# EAGLE design TeensySonarBoard (EAGLE 7.7.0)
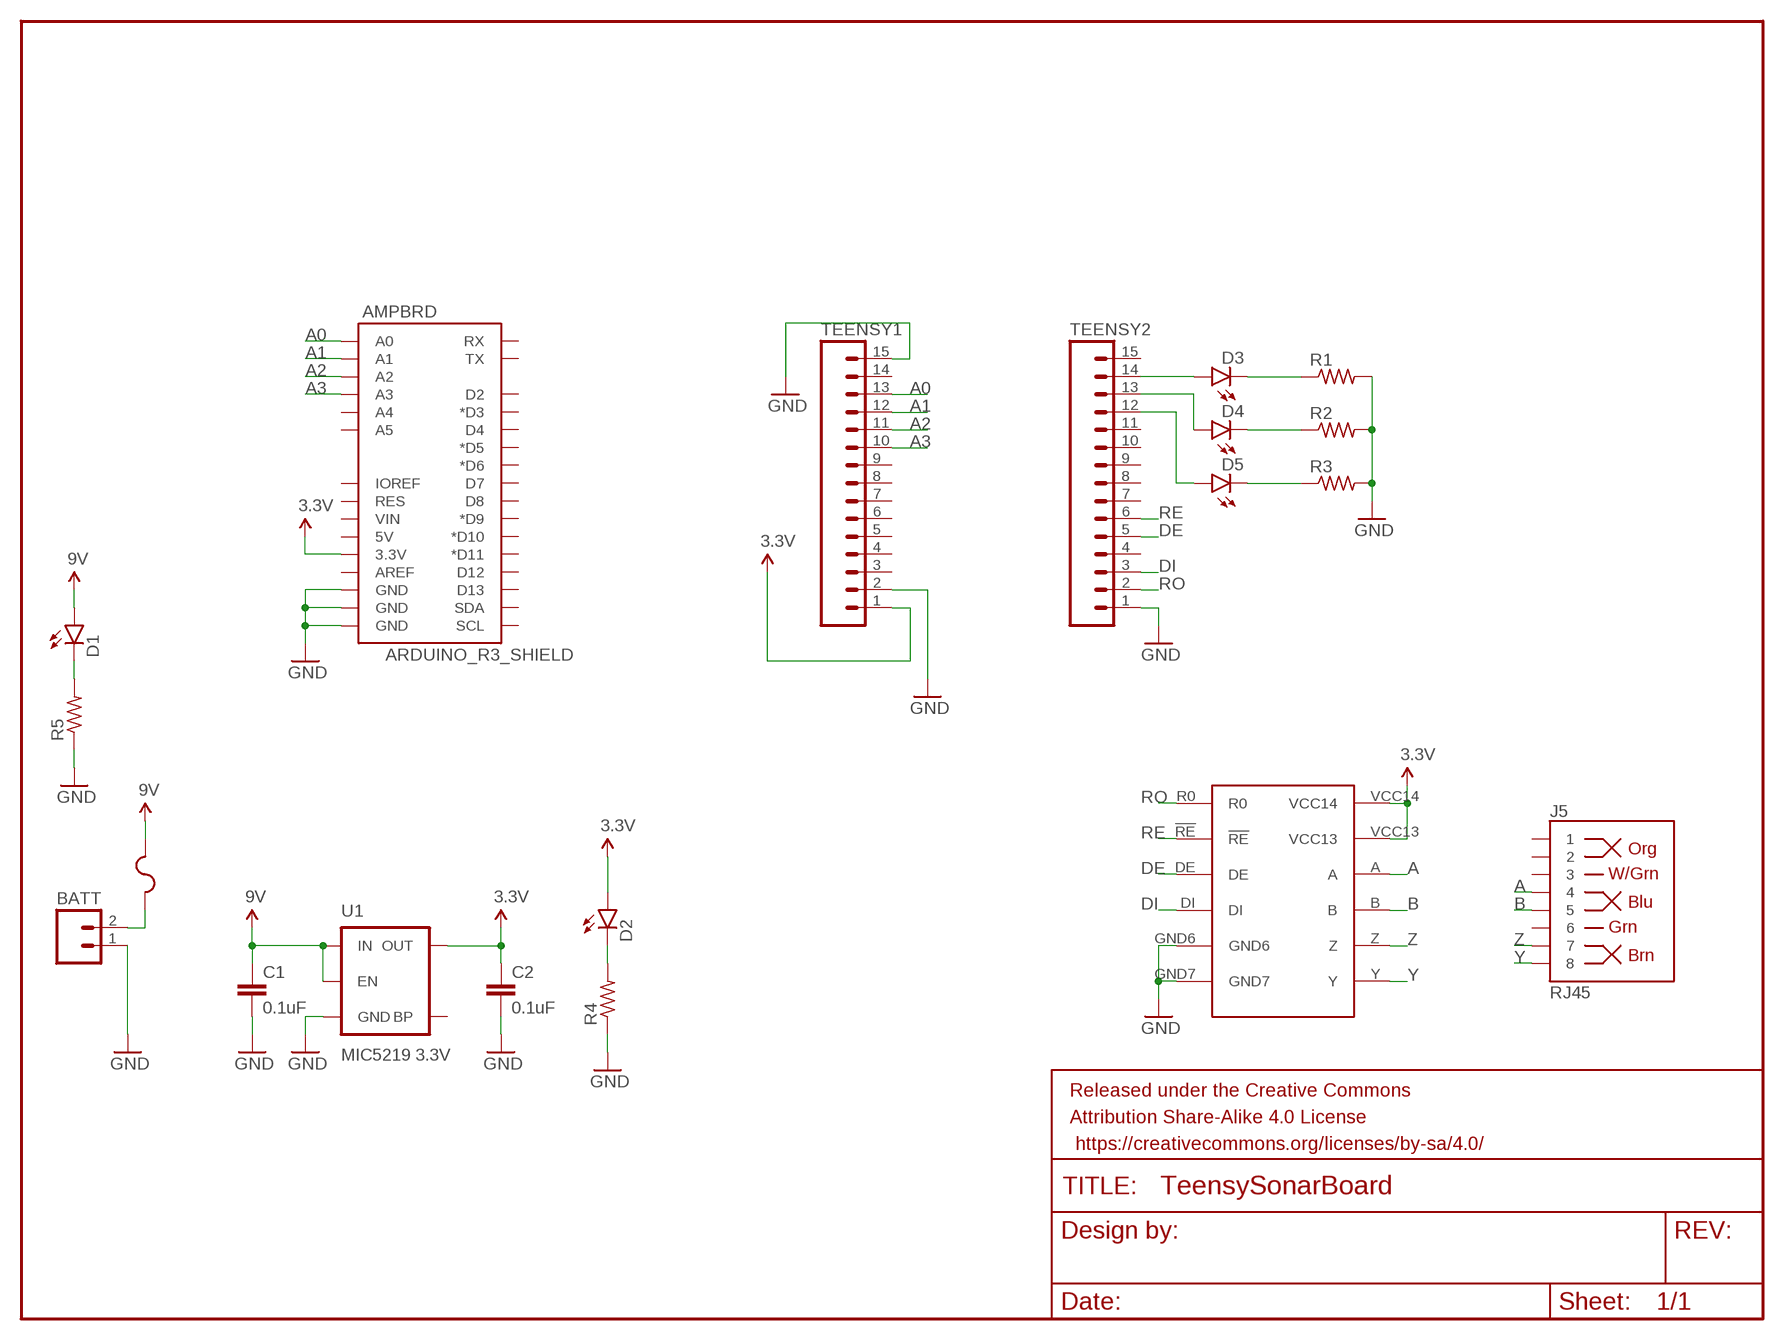
[diagram p0: schematic, sheet 1]

## Parts
AMPBRD  ARDUINO_R3_SHIELD  [UNO_R3_SHIELD]
BATT  M02JST-PTH-VERT  [JST-2-PTH-VERT]
C1  0.1uF  CAP0603-CAP  [0603-CAP]
C2  0.1uF  CAP0603-CAP  [0603-CAP]
D1  LED0603  [LED-0603]
D2  LED0603  [LED-0603]
D3  LED0603  [LED-0603]
D4  LED0603  [LED-0603]
D5  LED0603  [LED-0603]
F1  2A  KEYSTONE_FUSE_3587  [KEYSTONE_FUSE_3587]
FRAME1  FRAME-LETTERNO_PACKAGE  [DUMMY]
J5  RJ45  RJ45-8PTH  [RJ45-8]
R1  R-US_R0603  [R0603]
R2  R-US_R0603  [R0603]
R3  R-US_R0603  [R0603]
R4  R-US_R0603  [R0603]
R5  R-US_R0603  [R0603]
TEENSY1  M15  [1X15]
TEENSY2  M15  [1X15]
U1  MIC5219 3.3V  V_REG_MIC52193.3V  [SOT23-5]
U$1  MAX3491  [MAX3491]

## Nets
3.3V: AMPBRD.3.3V C2.1 D2.A TEENSY1.1 U1.5(OUT) U$1.VCC13 U$1.VCC14
A: J5.4 U$1.A
A0: AMPBRD.A0 TEENSY1.13
A1: AMPBRD.A1 TEENSY1.12
A2: AMPBRD.A2 TEENSY1.11
A3: AMPBRD.A3 TEENSY1.10
B: J5.5 U$1.B
DE: TEENSY2.5 U$1.DE
DI: TEENSY2.3 U$1.DI
GND: AMPBRD.GND@0(GND) AMPBRD.GND@1(GND) AMPBRD.GND@2(GND) BATT.1 C1.2 C2.2 R1.2 R2.2 R3.2 R4.1 R5.1 TEENSY1.2 TEENSY1.15 TEENSY2.1 U1.2(GND) U$1.GND6 U$1.GND7
N$1: BATT.2 F1.P$1 F1.P$2
N$2: D3.A TEENSY2.14
N$3: D4.A TEENSY2.13
N$4: D5.A TEENSY2.12
N$5: D1.C R5.2
N$6: D2.C R4.2
N$7: D3.C R1.1
N$8: D4.C R2.1
N$9: D5.C R3.1
RE: TEENSY2.6 U$1.!RE
RO: TEENSY2.2 U$1.R0
VCC: C1.1 D1.A F1.P$3 F1.P$4 U1.1(IN) U1.3(EN) ; supply symbol labelled 9V
Y: J5.8 U$1.Y
Z: J5.7 U$1.Z
Unconnected: AMPBRD.5V AMPBRD.A4 AMPBRD.A5 AMPBRD.AREF AMPBRD.D2 AMPBRD.D3(*D3) AMPBRD.D4 AMPBRD.D5(*D5) AMPBRD.D6(*D6) AMPBRD.D7 AMPBRD.D8 AMPBRD.D9(*D9) AMPBRD.D10(*D10) AMPBRD.D11(*D11) AMPBRD.D12 AMPBRD.D13 AMPBRD.IOREF AMPBRD.RES AMPBRD.RX AMPBRD.SCL AMPBRD.SDA AMPBRD.TX AMPBRD.VIN J5.1 J5.2 J5.3 J5.6 TEENSY1.3 TEENSY1.4 TEENSY1.5 TEENSY1.6 TEENSY1.7 TEENSY1.8 TEENSY1.9 TEENSY1.14 TEENSY2.4 TEENSY2.7 TEENSY2.8 TEENSY2.9 TEENSY2.10 TEENSY2.11 TEENSY2.15 U1.4(BP)

## Library data of the parts
AMPBRD = SparkFun-Boards:ARDUINO_R3_SHIELD: Shield form compatible with the Arduino Uno R3.
BATT = SparkFun-Connectors:M02: Standard 2-pin 0.1" header. Use with - straight break away headers ( PRT-00116) - right angle break away headers (PRT-00553) - swiss pins (PRT-00743) - machine pins (PRT-00117) - female headers (PRT-00115) Molex polarized connector foot print use with: PRT-08233 with associated crimp pins and housings. 2.54_SCREWTERM for use with PRT-10571. 3.5mm Screw Terminal footprints for PRT-08084 5mm Screw Terminal footprints for use with PRT-08432
C1 C2 = SparkFun-Capacitors:CAP: Capacitor Standard 0603 ceramic capacitor, and 0.1" leaded capacitor.
D1-D5 = SparkFun-LED:LED: LEDs Standard schematic elements and footprints for 5mm, 3mm, 1206, and 0603 sized LEDs. 5mm - Spark Fun Electronics SKU : COM-00529 (and others)
F1 = MotherboardParts:KEYSTONE_FUSE_3587
FRAME1 = SparkFun-Aesthetics:FRAME-LETTER: Schematic Frame Standard 8.5x11 US Letter frame; DESIGNER: Nobody; VERSION: v01
J5 = SparkFun-Connectors:RJ45-8: RJ45 Jack Simple RJ45, 8-pin connection - connector for common Cat5, Cat5e, and Cat6 Ethernet cables. Footprint not yet proven in production. Connector sku is PRT-00643; Breakout PCB sku is BOB-00716.; PROD_ID: CONN-08506
R1-R5 = resistor:R-US_: RESISTOR, American symbol
TEENSY1 TEENSY2 = SparkFun-Connectors:M15: Header 15 Standard 15-pin 0.1" header. Use with straight break away headers (SKU : PRT-00116), right angle break away headers (PRT-00553), swiss pins (PRT-00743), machine pins (PRT-00117), and female headers (PRT-00115).
U1 = SparkFun-PowerIC:V_REG_MIC5219: V_REG MIC5219 Standard 3.3V and 5V 500mA LDO voltage regulator in SOT-23 layout. Micrel part MIC5219. BP (by-pass) pin is used to lower output noise with 470pF cap, may be left open.; PROD_ID: VREG-09872
U$1 = BackplaneParts:MAX3491

## Board
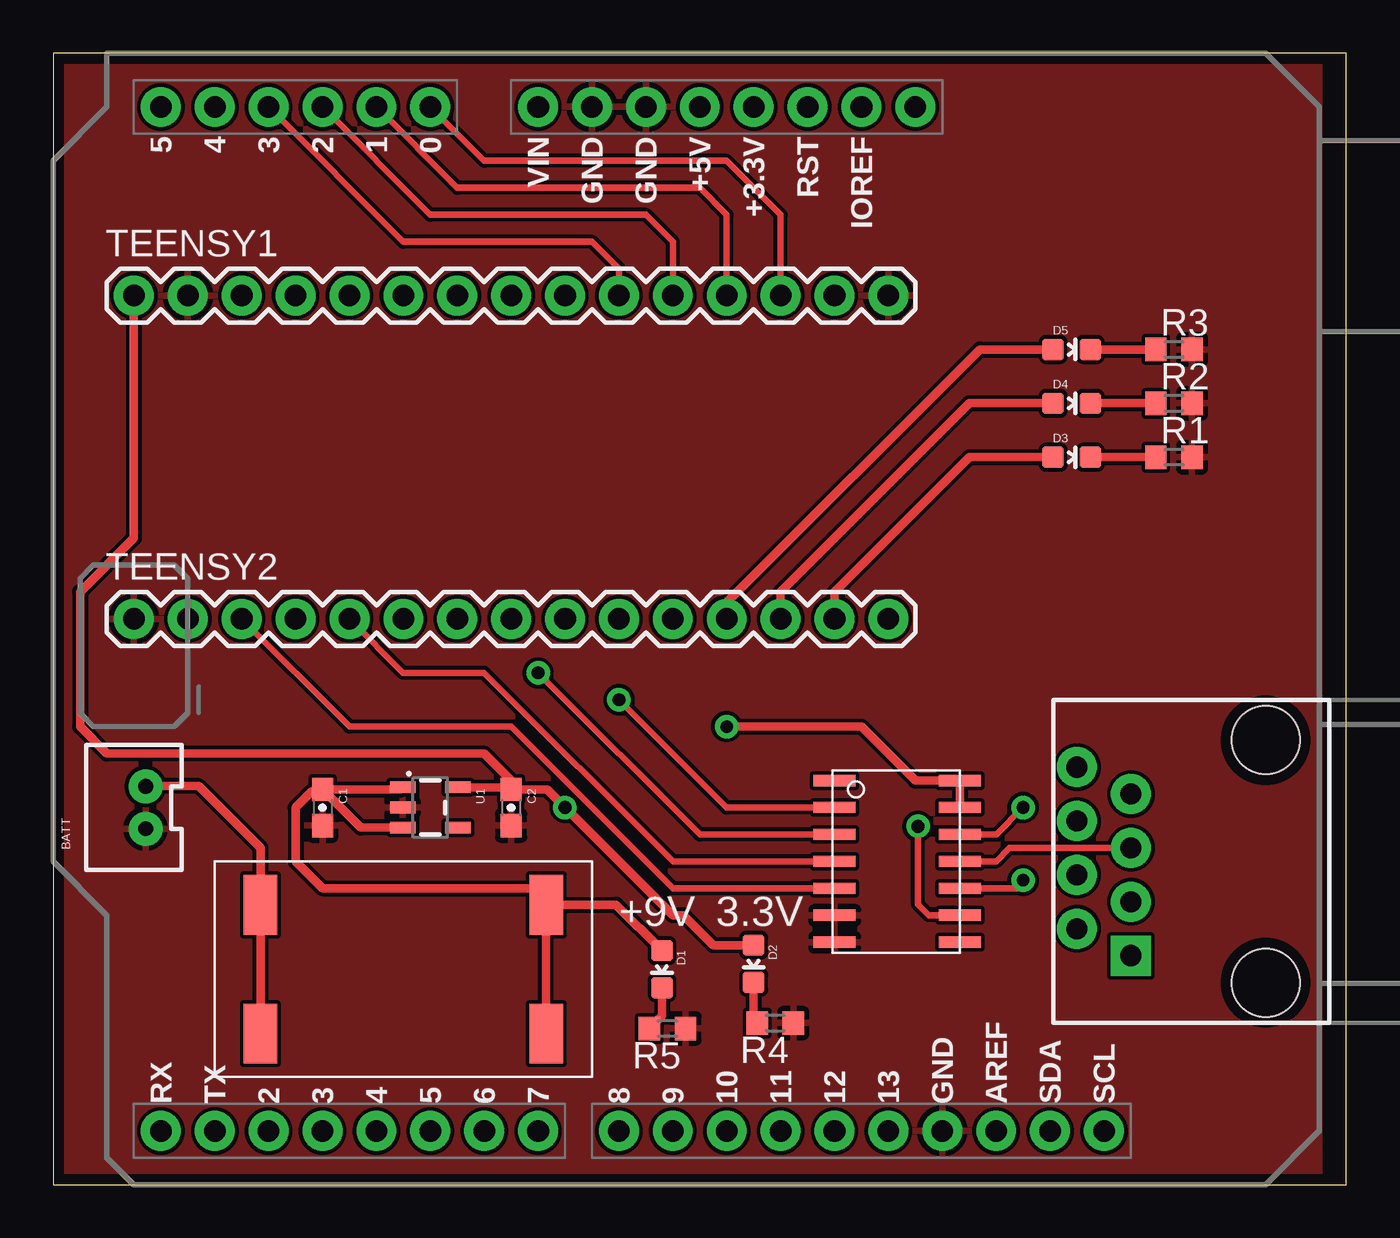
[diagram p1: board, top side]
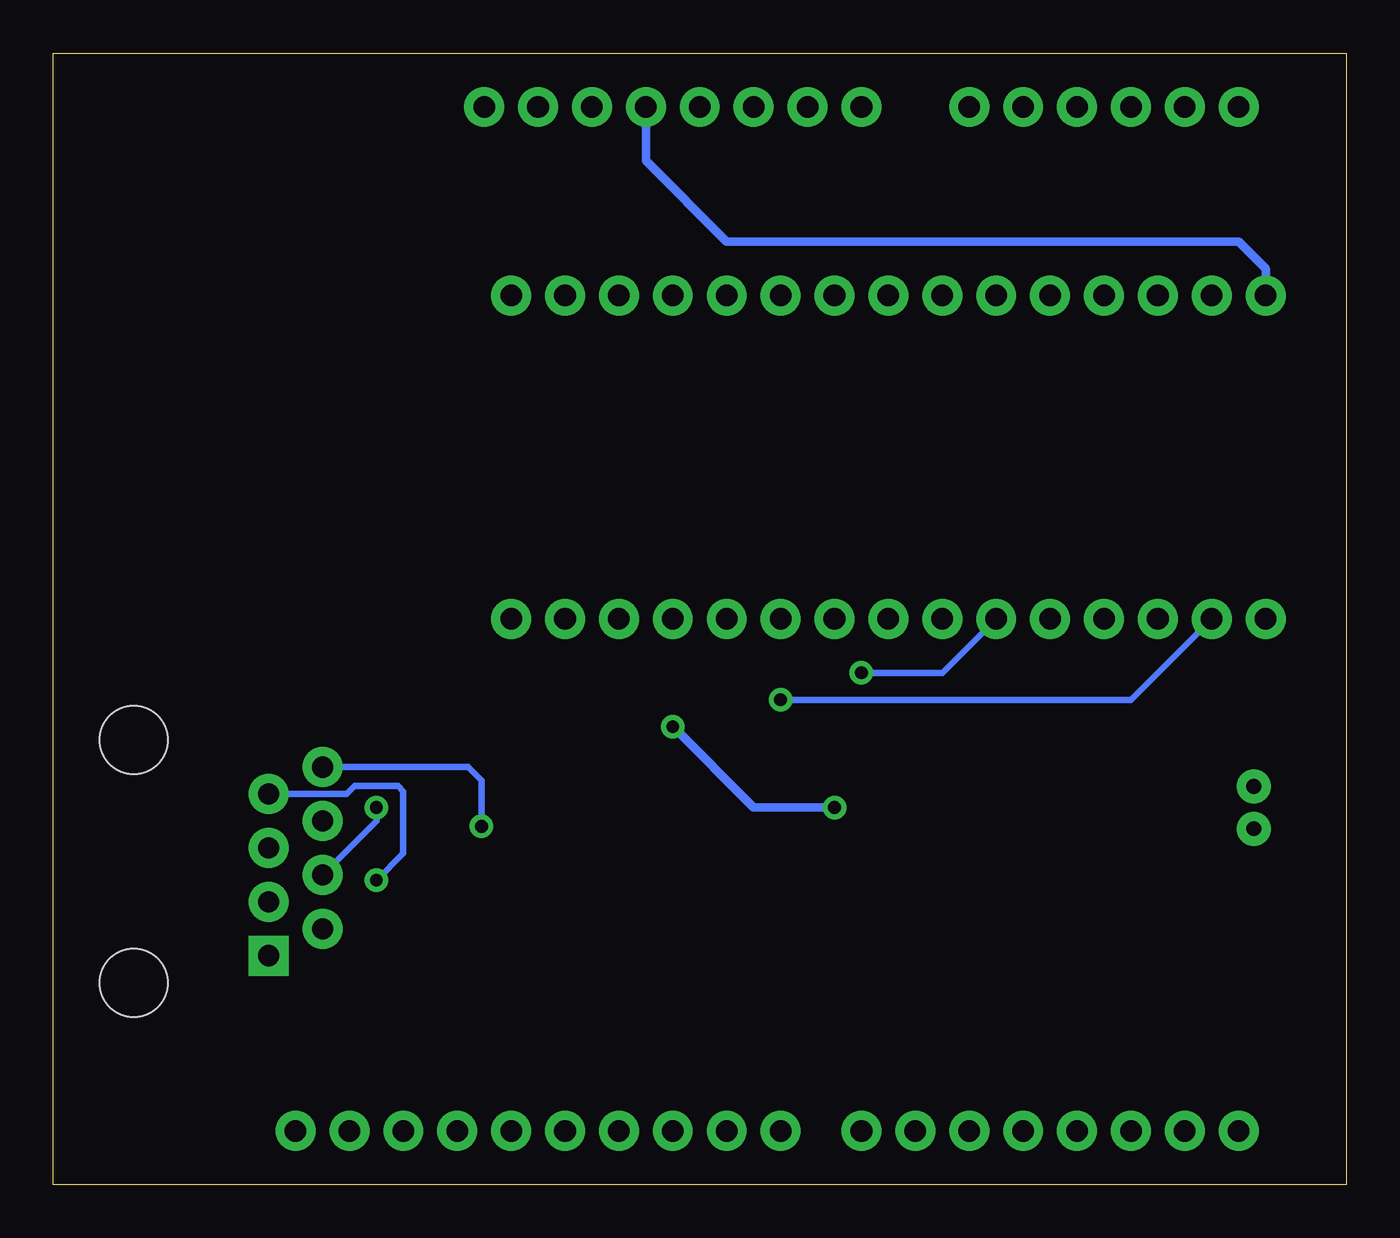
[diagram p2: board, bottom side, seen from below]

Size 60.96 x 53.34 mm. Coordinates in mm from the lower left corner, seen from the top.
Outline: 0,0 60.96,0 60.96,53.34 0,53.34 0,0
Copper layers (1*16): Top 0.035mm / dielectric 1.5mm / Bottom 0.035mm
Design rules "GoldPhoenix *": minimum track width 7mil, minimum drill 10mil, track to track 7mil, track to pad 7mil, pad to pad 7mil, via to via 7mil, smd to smd 7mil, copper to edge 20mil, drill to drill 8mil, minimum pad ring 10mil, minimum via ring 10mil, stop-mask expansion 4mil, vias tented up to drill 25mil, thermal gap 10mil

### Footprints (pad centres in the part's own frame; a part is rotated, then mirrored left to right if it is on the bottom)
UNO_R3_SHIELD = drill 1.016 pad 1.88: 3.3V 50.8,26.67; 5V 50.8,29.21; A0 50.8,41.91; A1 50.8,44.45; A2 50.8,46.99; A3 50.8,49.53; A4 50.8,52.07; A5 50.8,54.61; AREF 2.54,15.24; D2 2.54,49.53; D3 2.54,46.99; D4 2.54,44.45; D5 2.54,41.91; D6 2.54,39.37; D7 2.54,36.83; D8 2.54,33.02; D9 2.54,30.48; D10 2.54,27.94; D11 2.54,25.4; D12 2.54,22.86; D13 2.54,20.32; GND@0 50.8,31.75; GND@1 50.8,34.29; GND@2 2.54,17.78; IOREF 50.8,21.59; NC 50.8,19.05; RES 50.8,24.13; RX 2.54,54.61; SCL 2.54,10.16; SDA 2.54,12.7; TX 2.54,52.07; VIN 50.8,36.83
JST-2-PTH-VERT = drill 0.7 pad 1.6: 1 -1,-0.55; 2 1,-0.55
0603-CAP = smd 1.1 x 1: 1 -0.85,0; 2 0.85,0
LED-0603 = smd 1 x 1: A 0,-0.877; C 0,0.877
KEYSTONE_FUSE_3587 = smd 1.575 x 2.819: P$1 -6.731,3.035; P$2 -6.731,-3.035; P$3 6.731,-3.035; P$4 6.731,3.035
RJ45-8 = drill 1 pad 1.88 square: 1 -4.445,6.35 | drill 1 pad 1.88: 2 -3.175,8.89; 3 -1.905,6.35; 4 -0.635,8.89; 5 0.635,6.35; 6 1.905,8.89; 7 3.175,6.35; 8 4.445,8.89 | hole 3.2: -5.715,0; 5.715,0
R0603 = smd 1 x 1.1: 1 -0.85,0; 2 0.85,0
1X15 = drill 1.016 pad 1.88: 1 0,0; 2 2.54,0; 3 5.08,0; 4 7.62,0; 5 10.16,0; 6 12.7,0; 7 15.24,0; 8 17.78,0; 9 20.32,0; 10 22.86,0; 11 25.4,0; 12 27.94,0; 13 30.48,0; 14 33.02,0; 15 35.56,0
SOT23-5 = smd 0.55 x 1.2: 1 -0.95,-1.3; 2 0,-1.3; 3 0.95,-1.3; 4 0.95,1.3; 5 -0.95,1.3
MAX3491 = smd 1.981 x 0.533: !RE 0,5.08; A 5.918,5.08; B 5.918,3.81; DE 0,3.81; DI 0,2.54; GND6 0,1.27; GND7 0,0; NC1 0,7.62; NC8 5.918,0; R0 0,6.35; VCC13 5.918,6.35; VCC14 5.918,7.62; Y 5.918,1.27; Z 5.918,2.54

### Placement (x,y rotation side)
AMPBRD  59.69,0 90 top
BATT  3.81,17.78 90 top
C1  12.7,17.78 270 top
C2  21.59,17.78 270 top
D1  28.7,10.16 180 top
D2  33.02,10.41 180 top
D3  48.01,34.29 270 top
D4  48.01,36.83 270 top
D5  48.01,39.37 270 top
F1  16.51,10.16 0 top
FRAME1  -5.08,-7.62 0 top  (outside the outline)
J5  57.15,15.24 90 top
R1  52.83,34.29 0 top
R2  52.83,36.83 0 top
R3  52.83,39.37 0 top
R4  34.04,7.62 180 top
R5  28.96,7.37 180 top
TEENSY1  3.81,41.91 0 top
TEENSY2  3.81,26.67 0 top
U1  17.78,17.78 270 top
U$1  36.83,11.43 0 top

### Tracks (layer width: path | path; a pad name or v marks a point on that pad's centre or on a via)
3.3V  (via drill 0.6)
  Top 0.406: TEENSY1.1 3.81,30.48 1.27,27.94 1.27,21.59 2.54,20.32 20.32,20.32 21.59,19.05 C2.1 | 43.18,17.78 U$1.VCC13 U$1.VCC14 40.64,19.05 38.1,21.59 v31.75,21.59 | U1.5 21.49,18.73 C2.1 | C2.1 23.28,18.63 v24.13,17.78 29.21,12.7 29.72,12.7 31.13,11.29 D2.A
  Bottom 0.406: TEENSY1.1 3.81,43.18 5.08,44.45 29.21,44.45 33.02,48.26 AMPBRD.3.3V | v24.13,17.78 27.94,17.78 v31.75,21.59
A  (via drill 0.6)
  Top 0.305: U$1.A 44.45,16.51 v45.72,17.78
  Bottom 0.305: v45.72,17.78 45.72,17.14 J5.4
A0
  Top 0.305: TEENSY1.13 34.29,45.72 31.75,48.26 20.32,48.26 AMPBRD.A0
A1
  Top 0.305: TEENSY1.12 31.75,45.72 30.48,46.99 19.05,46.99 AMPBRD.A1
A2
  Top 0.305: TEENSY1.11 29.21,44.45 27.94,45.72 17.78,45.72 AMPBRD.A2
A3
  Top 0.305: TEENSY1.10 26.67,43.18 25.4,44.45 16.51,44.45 AMPBRD.A3
B
  Top 0.305: U$1.B 44.45,15.24 45.09,15.88 J5.5
DE
  Top 0.305: U$1.DE 29.21,15.24 20.32,24.13 16.51,24.13 TEENSY2.5
DI
  Top 0.305: U$1.DI 29.21,13.97 21.59,21.59 13.97,21.59 TEENSY2.3
GND
  pour Top: 0,0 0,53.34 59.69,53.34 59.69,0
N$1
  Top 0.406: F1.P$2 F1.P$1 9.78,15.88 6.86,18.8 4.38,18.8 BATT.2
N$2
  Top 0.406: TEENSY2.14 36.83,27.94 43.18,34.29 D3.A
N$3
  Top 0.406: TEENSY2.13 34.29,27.94 43.18,36.83 D4.A
N$4
  Top 0.406: TEENSY2.12 31.75,27.43 43.69,39.37 D5.A
N$5
  Top 0.406: D1.C 28.7,7.96 R5.2
N$6
  Top 0.406: D2.C 33.02,7.79 R4.2
N$7
  Top 0.406: D3.C R1.1
N$8
  Top 0.406: D4.C R2.1
N$9
  Top 0.406: D5.C R3.1
RE  (via drill 0.6)
  Top 0.305: U$1.!RE 30.48,16.51 v22.86,24.13
  Bottom 0.305: v22.86,24.13 19.05,24.13 TEENSY2.6
RO  (via drill 0.6)
  Top 0.305: U$1.R0 31.75,17.78 v26.67,22.86
  Bottom 0.305: v26.67,22.86 10.16,22.86 TEENSY2.2
VCC
  Top 0.406: 12.55,18.78 C1.1 | C1.1 16.38,18.63 U1.1 | U1.3 14.5,16.83 C1.1 | C1.1 12.61,18.54 12.19,18.54 11.43,17.78 11.43,15.24 12.7,13.97 22.86,13.97 23.24,13.59 F1.P$4 | F1.P$3 F1.P$4 | F1.P$4 26.54,13.2 D1.A
Y  (via drill 0.6)
  Top 0.305: U$1.Y 41.27,12.7 40.77,13.21 v40.77,16.89
  Bottom 0.305: v40.77,16.89 40.77,19.05 41.4,19.68 J5.8
Z  (via drill 0.6)
  Top 0.305: v45.72,14.35 45.72,14.1 45.59,13.97 U$1.Z
  Bottom 0.305: J5.7 47.12,18.41 46.74,18.8 44.7,18.8 44.45,18.54 44.45,15.62 v45.72,14.35

### Text on the board
tPlace: +9V | 3.3V